# Altium schematic sheet buffer.SchDoc
size A3
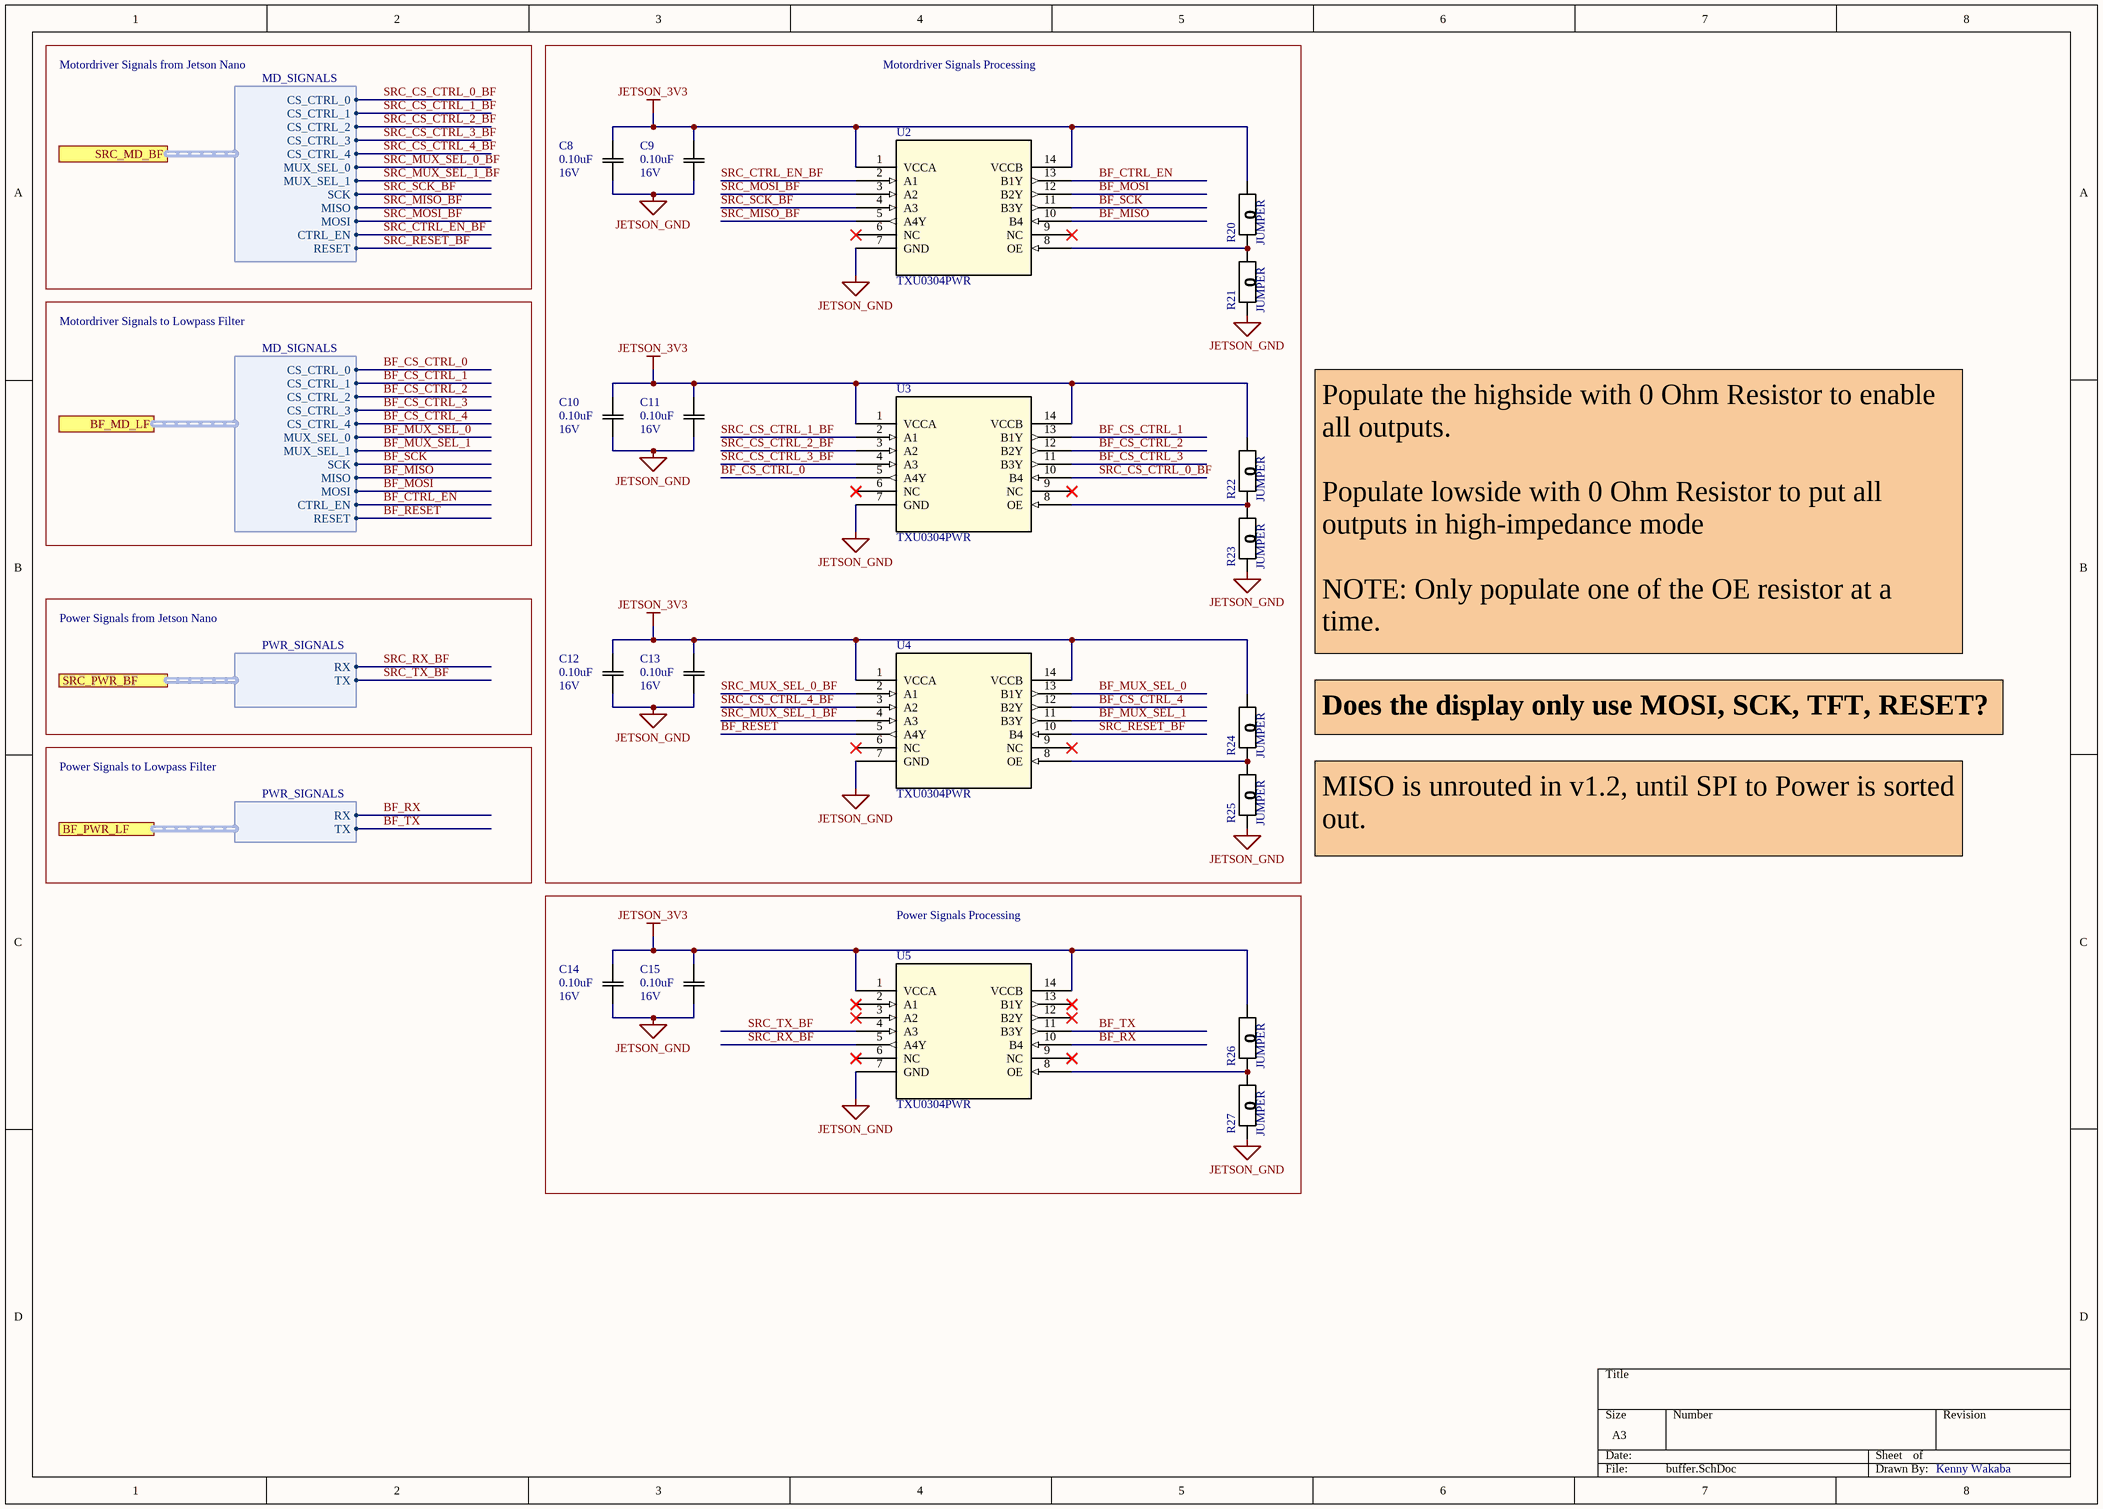
[diagram p0: buffer.SchDoc]

## Parts
C8  Rating: 16V  [0603]  (hidden comment: 0.10uF)
C9  Rating: 16V  [0603]  (hidden comment: 0.10uF)
C10  Rating: 16V  [0603]  (hidden comment: 0.10uF)
C11  Rating: 16V  [0603]  (hidden comment: 0.10uF)
C12  Rating: 16V  [0603]  (hidden comment: 0.10uF)
C13  Rating: 16V  [0603]  (hidden comment: 0.10uF)
C14  Rating: 16V  [0603]  (hidden comment: 0.10uF)
C15  Rating: 16V  [0603]  (hidden comment: 0.10uF)
R20  JUMPER  [0603]
R21  JUMPER  [0603]
R22  JUMPER  [0603]
R23  JUMPER  [0603]
R24  JUMPER  [0603]
R25  JUMPER  [0603]
R26  JUMPER  [0603]
R27  JUMPER  [0603]
U2  TXU0304PWR  [14-TSSOP]
U3  TXU0304PWR  [14-TSSOP]
U4  TXU0304PWR  [14-TSSOP]
U5  TXU0304PWR  [14-TSSOP]

## Blocks framed on the sheet
Motordriver Signals Processing: C8-C13 R20-R25 U2-U4
Power Signals Processing: C14 C15 R26 R27 U5

## Ports
BF_MD_LF (harness MD_SIGNALS), BF_PWR_LF (harness PWR_SIGNALS), SRC_MD_BF (harness MD_SIGNALS), SRC_PWR_BF (harness PWR_SIGNALS)

## Harnesses
PWR_SIGNALS: TX, RX
MD_SIGNALS: CS_CTRL_0, MUX_SEL_1, SCK, MOSI, MISO, CS_CTRL_1, CS_CTRL_2, CS_CTRL_3, CS_CTRL_4, MUX_SEL_0, CTRL_EN, RESET

## Nets
JETSON_3V3: C8.1(C1) C9.1(C1) C10.1(C1) C11.1(C1) C12.1(C1) C13.1(C1) C14.1(C1) C15.1(C1) R20.1(R1) R22.1(R1) R24.1(R1) R26.1(R1) U2.1(VCCA) U2.14(VCCB) U3.1(VCCA) U3.14(VCCB) U4.1(VCCA) U4.14(VCCB) U5.1(VCCA) U5.14(VCCB)
JETSON_GND: C8.2(C2) C9.2(C2) C10.2(C2) C11.2(C2) C12.2(C2) C13.2(C2) C14.2(C2) C15.2(C2) R21.2(R2) R23.2(R2) R25.2(R2) R27.2(R2) U2.7(GND) U3.7(GND) U4.7(GND) U5.7(GND)
BF_CS_CTRL_0: U3.5(A4Y) ; port BF_MD_LF.CS_CTRL_0
BF_CS_CTRL_1: U3.13(B1Y) ; port BF_MD_LF.CS_CTRL_1
BF_CS_CTRL_2: U3.12(B2Y) ; port BF_MD_LF.CS_CTRL_2
BF_CS_CTRL_3: U3.11(B3Y) ; port BF_MD_LF.CS_CTRL_3
BF_CS_CTRL_4: U4.12(B2Y) ; port BF_MD_LF.CS_CTRL_4
BF_CTRL_EN: U2.13(B1Y) ; port BF_MD_LF.CTRL_EN
BF_MISO: U2.10(B4) ; port BF_MD_LF.MISO
BF_MOSI: U2.12(B2Y) ; port BF_MD_LF.MOSI
BF_MUX_SEL_0: U4.13(B1Y) ; port BF_MD_LF.MUX_SEL_0
BF_MUX_SEL_1: U4.11(B3Y) ; port BF_MD_LF.MUX_SEL_1
BF_RESET: U4.5(A4Y) ; port BF_MD_LF.RESET
BF_RX: U5.10(B4) ; port BF_PWR_LF.RX
BF_SCK: U2.11(B3Y) ; port BF_MD_LF.SCK
BF_TX: U5.11(B3Y) ; port BF_PWR_LF.TX
SRC_CS_CTRL_0_BF: U3.10(B4) ; port SRC_MD_BF.CS_CTRL_0
SRC_CS_CTRL_1_BF: U3.2(A1) ; port SRC_MD_BF.CS_CTRL_1
SRC_CS_CTRL_2_BF: U3.3(A2) ; port SRC_MD_BF.CS_CTRL_2
SRC_CS_CTRL_3_BF: U3.4(A3) ; port SRC_MD_BF.CS_CTRL_3
SRC_CS_CTRL_4_BF: U4.3(A2) ; port SRC_MD_BF.CS_CTRL_4
SRC_CTRL_EN_BF: U2.2(A1) ; port SRC_MD_BF.CTRL_EN
SRC_MISO_BF: U2.5(A4Y) ; port SRC_MD_BF.MISO
SRC_MOSI_BF: U2.3(A2) ; port SRC_MD_BF.MOSI
SRC_MUX_SEL_0_BF: U4.2(A1) ; port SRC_MD_BF.MUX_SEL_0
SRC_MUX_SEL_1_BF: U4.4(A3) ; port SRC_MD_BF.MUX_SEL_1
SRC_RESET_BF: U4.10(B4) ; port SRC_MD_BF.RESET
SRC_RX_BF: U5.5(A4Y) ; port SRC_PWR_BF.RX
SRC_SCK_BF: U2.4(A3) ; port SRC_MD_BF.SCK
SRC_TX_BF: U5.4(A3) ; port SRC_PWR_BF.TX
NetR20_2: R20.2(R2) R21.1(R1) U2.8(OE)
NetR22_2: R22.2(R2) R23.1(R1) U3.8(OE)
NetR24_2: R24.2(R2) R25.1(R1) U4.8(OE)
NetR26_2: R26.2(R2) R27.1(R1) U5.8(OE)

Not connected (* = marked no-connect by the designer): U2 6(NC)* 9(NC)*; U3 6(NC)* 9(NC)*; U4 6(NC)* 9(NC)*; U5 2(A1)* 3(A2)* 6(NC)* 9(NC)* 12(B2Y)* 13(B1Y)*

## Notes on the sheet
- Motordriver Signals from Jetson Nano
- Motordriver Signals to Lowpass Filter
- Power Signals from Jetson Nano
- Populate the highside with 0 Ohm Resistor to enable all outputs.
  Populate lowside with 0 Ohm Resistor to put all outputs in high-impedance mode
  NOTE: Only populate one of the OE resistor at a time.
- Power Signals to Lowpass Filter
- Does the display only use MOSI, SCK, TFT, RESET?
- MISO is unrouted in v1.2, until SPI to Power is sorted out.
- Kenny Wakaba

## Library data of the parts
C8-C15 = CAP 0.10uF 16V: CAP CER 0.10UF 16V X5R 0603; Tolerance: 10%; Package: 0603/0805; Temperature Coefficient: X5R; Operating Temperature: -55°C ~ 85°C; Value: 0.10uF; Part Number: CAP 0.10uF 16V
R20-R27 = RES 0 JUMPER: RES SMD 0 OHM JUMPER GENERIC 0603; Manufacturer Part Number 1: RK73Z1JTTD; Value: 0; Package: 0805; Part Number: RES 0 JUMPER; Tolerance: N/A; Supplier 1: Digi-Key; Supplier Part Number 1: 2019-RK73Z1JTTDCT-ND; Supplier URL 1: https://www.digikey.ca/en/products/detail/koa-speer-electronics-inc/RK73Z1JTTD/9845478
U2-U5 = TXU0304: 4-Bit Fixed Direction Voltage-Level Translator with Schmitt-Trigger Inputs  and 3-State Outputs; Mfr_Name: Texas Instruments; Copyright: Copyright (C) 2022 Ultra Librarian. All rights reserved.; Manufacturer_Part_Number: TXU0304PWR; Digi-Key_Part_Number_1: 296-TXU0304PWRTR-ND; Digi-Key_Part_Number_2: 296-TXU0304PWRCT-ND; Digi-Key_Part_Number_3: 296-TXU0304PWRDKR-ND; RefDes: RefDes; Type: DEV; Part Number: TXU0304; Supplier 1: Digi-Key; Supplier Part Number 1: 296-TXU0304PWRTR-ND; Supplier URL 1: https://www.digikey.ca/en/products/detail/texas-instruments/TXU0304PWR/14641423